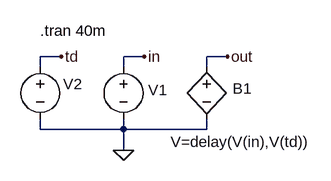
[diagram p0: schematic phase_shift_modulator.asc]
phase_shift_modulator.asc, the LTspice schematic file:
Version 4
SHEET 1 880 680
WIRE -32 128 -64 128
WIRE 96 128 64 128
WIRE 224 128 192 128
WIRE -64 144 -64 128
WIRE 64 144 64 128
WIRE 192 144 192 128
WIRE -64 240 -64 224
WIRE 64 240 64 224
WIRE 64 240 -64 240
WIRE 192 240 192 224
WIRE 192 240 64 240
WIRE 64 272 64 240
FLAG 64 272 0
FLAG -32 128 td
FLAG 96 128 in
FLAG 224 128 out
SYMBOL bv 192 128 R0
WINDOW 0 40 49 Left 0
WINDOW 3 -55 131 Left 0
SYMATTR InstName B1
SYMATTR Value V=delay(V(in),V(td))
SYMATTR Value2 tripdt=10n tripdv=.1
SYMBOL voltage 64 128 R0
WINDOW 0 38 51 Left 0
WINDOW 3 24 104 Invisible 0
WINDOW 123 0 0 Left 0
WINDOW 39 0 0 Left 0
SYMATTR InstName V1
SYMATTR Value PULSE(0 1 0 .01m .01m .99m 2m)
SYMBOL voltage -64 128 R0
WINDOW 0 35 42 Left 0
WINDOW 3 24 104 Invisible 0
WINDOW 123 0 0 Left 0
WINDOW 39 0 0 Left 0
SYMATTR InstName V2
SYMATTR Value PULSE(0 1e-3 0 20m 20m 0 40m)
TEXT -64 88 Left 0 !.tran 40m

The netlist it stands for:
* phase_shift_modulator.asc
B1 out 0 V=delay(V(in),V(td)) tripdt=10n tripdv=.1
V1 in 0 PULSE(0 1 0 .01m .01m .99m 2m)
V2 td 0 PULSE(0 1e-3 0 20m 20m 0 40m)
.tran 40m
.backanno
.end